# EAGLE schematic tpa6120a2_headamp (EAGLE 9.5.1)
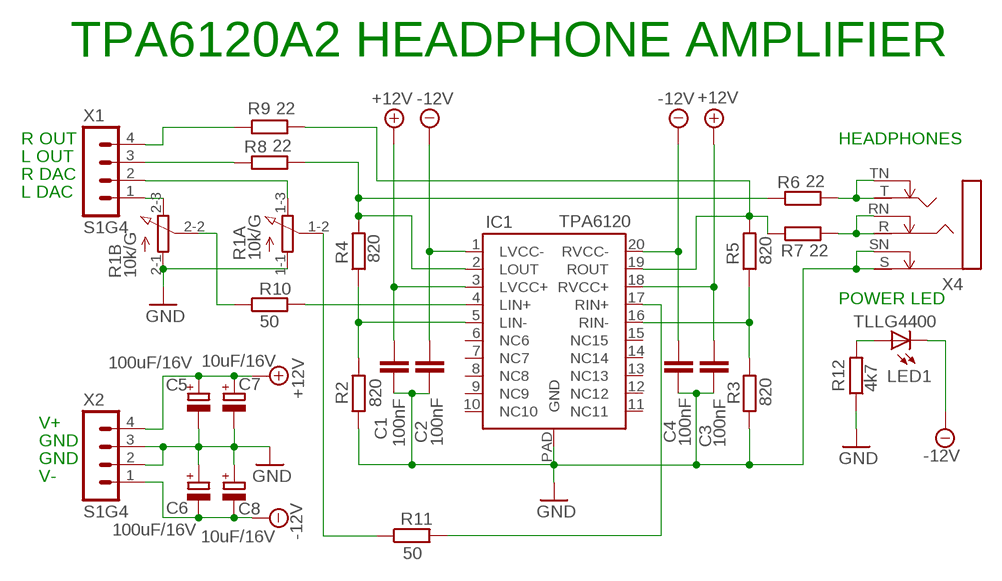
[diagram p0: schematic, sheet 1]

## Parts
C1  100nF  C-EUC1206  [C1206]
C2  100nF  C-EUC1206  [C1206]
C3  100nF  C-EUC1206  [C1206]
C4  100nF  C-EUC1206  [C1206]
C5  100uF/16V  CPOL-EUSMCD  [SMC_D]
C6  100uF/16V  CPOL-EUSMCD  [SMC_D]
C7  10uF/16V  CPOL-EUSMCC  [SMC_C]
C8  10uF/16V  CPOL-EUSMCC  [SMC_C]
IC1  TPA6120  [SO20POWERPAD]
LED1  TLLG4400  [LED3MM]
R1  10k/G  ALPS-RK27-DUAL  [ALPS-RK27-DUAL]
R2  820  R-EU_R1206  [R1206]
R3  820  R-EU_R1206  [R1206]
R4  820  R-EU_R1206  [R1206]
R5  820  R-EU_R1206  [R1206]
R6  22  R-EU_R1206  [R1206]
R7  22  R-EU_R1206  [R1206]
R8  22  R-EU_R1206  [R1206]
R9  22  R-EU_R1206  [R1206]
R10  50  R-EU_R1206  [R1206]
R11  50  R-EU_R1206  [R1206]
R12  4k7  R-EU_R1206  [R1206]
X1  S1G4  MA04-1  [MA04-1]
X2  S1G4  MA04-1  [MA04-1]
X4  NMJ6HCD2  [NMJ6HCD2]

## Nets
+12V: C1.1 C3.1 C5.+ C7.+ IC1.3(LVCC+) IC1.18(RVCC+) X2.4
-12V: C2.1 C4.1 C6.- C8.- IC1.1(LVCC-) IC1.20(RVCC-) LED1.K(C) X2.1
GND: C1.2 C2.2 C3.2 C4.2 C5.- C6.+ C7.- C8.+ IC1.PAD(GND) R1.1-1 R1.2-1 R2.1 R3.1 R12.1 X2.2 X2.3 X4.S X4.SN
N$1: IC1.19(ROUT) R5.2 R7.1 R9.2
N$2: IC1.5(LIN-) R2.2 R4.1
N$3: IC1.16(RIN-) R3.2 R5.1
N$4: IC1.2(LOUT) R4.2 R6.1 R8.2
N$5: R6.2 X4.T X4.TN
N$6: R1.2-3 X1.1
N$7: R1.1-3 X1.2
N$8: R1.2-2 R10.1
N$9: R1.1-2 R11.1
N$10: R7.2 X4.R X4.RN
N$11: IC1.4(LIN+) R10.2
N$12: IC1.17(RIN+) R11.2
N$13: LED1.A R12.2
N$17: R8.1 X1.3
N$18: R9.1 X1.4
Unconnected: IC1.6(NC6) IC1.7(NC7) IC1.8(NC8) IC1.9(NC9) IC1.10(NC10) IC1.11(NC11) IC1.12(NC12) IC1.13(NC13) IC1.14(NC14) IC1.15(NC15)

## Notes on the sheet
- TPA6120A2 HEADPHONE AMPLIFIER
- R OUT | HEADPHONES
- L OUT
- R DAC
- L DAC
- POWER LED
- V+
- GND
- GND
- V-

## Library data of the parts
C1-C4 = rcl:C-EU: CAPACITOR, European symbol
C5-C8 = rcl:CPOL-EU: POLARIZED CAPACITOR, European symbol
IC1 = pavouk:TPA6120: HIGH FIDELITY HEADPHONE AMPLIFIER
LED1 = led:TLLG4400: Low Current (2mA) LED 3 mm Tinted Diffused Package color GREEN Source: Data sheet <http://www.farnell.com/datasheets/391098.pdf>; MF: VISHAY SEMICONDUCTOR; OC_FARNELL: 1612435
R1 = pavouk:ALPS-RK27-DUAL: ALPS RK27-DUAL
R2-R12 = rcl:R-EU_: RESISTOR, European symbol
X1 X2 = con-lstb:MA04-1: PIN HEADER; OC_FARNELL: unknown; OC_NEWARK: unknown
X4 = pavouk:NMJ6HCD2: STEREO JACK SOCKET BY NEUTRIK